# EAGLE design trackuino-shield (EAGLE 5.11)
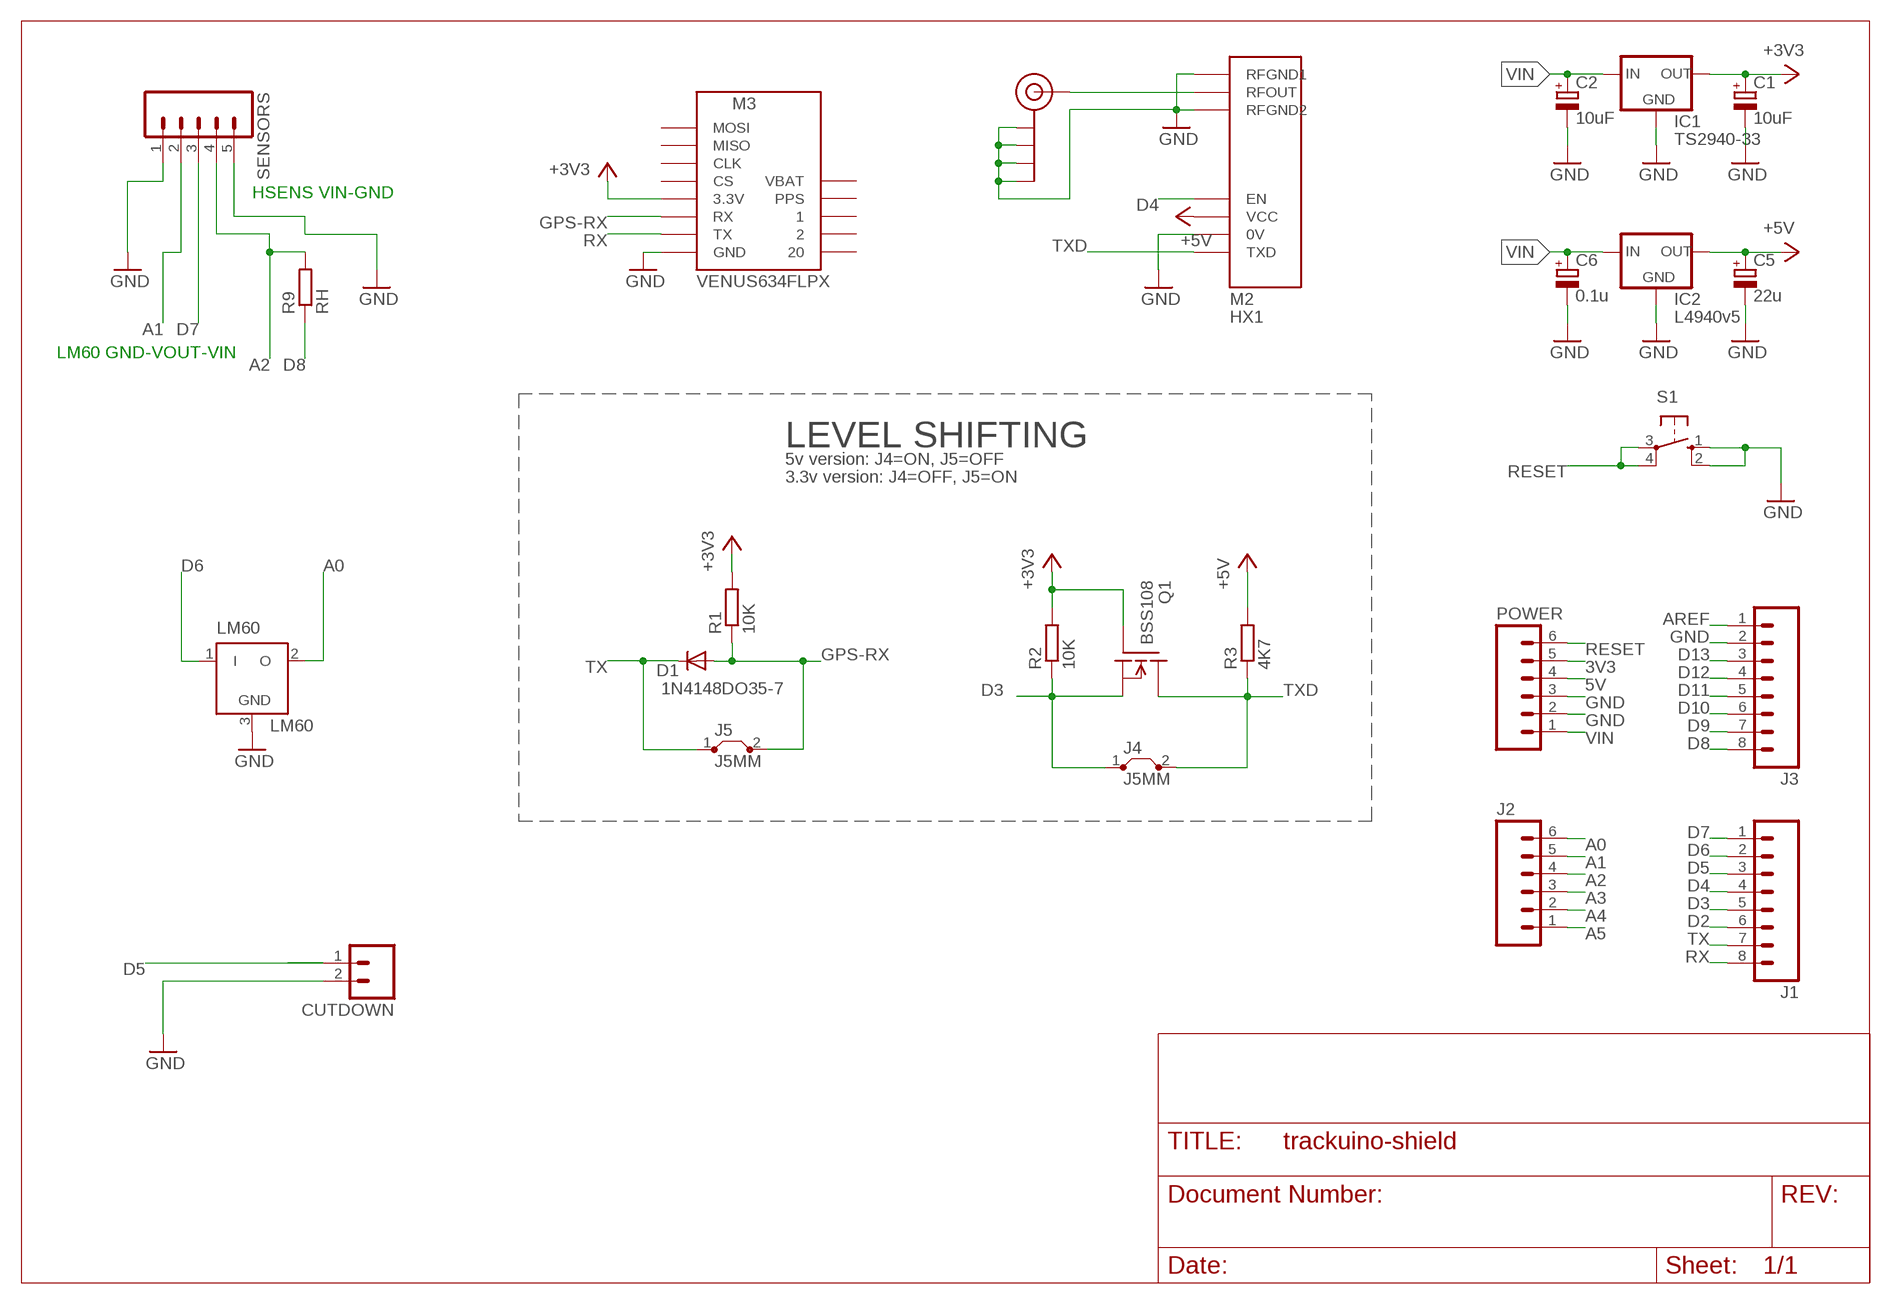
[diagram p0: schematic, sheet 1]

## Parts
C1  10uF  CPOL-EUE2.5-5  [E2,5-5]
C2  10uF  CPOL-EUE2.5-5  [E2,5-5]
C5  22u  CPOL-EUE2.5-5  [E2,5-5]
C6  0.1u  CPOL-EUE2.5-5  [E2,5-5]
CUTDOWN  M02  [1X02_LONGPADS]
D1  1N4148DO35-7  [DO35-7]
IC1  TS2940-33  78XXL  [78XXL]
IC2  L4940v5  78XXL  [78XXL]
J1  M08LONGPADS  [1X08_LONGPADS]
J2  M06LONGPADS  [1X06_LONGPADS]
J3  M08LONGPADS  [1X08_LONGPADS]
J4  J5MM  [05]
J5  J5MM  [05]
J$1  SMA_EDGE  [SMA-EDGE]
LM60  LM60  [TO92]
M2  HX1  [HX1]
M3  VENUS634FLPX  [VENUS634FLPX]
POWER  M06LONGPADS  [1X06_LONGPADS]
Q1  BSS108  BSS101  [TO92]
R1  10K  R-EU_0207/7  [0207/7]
R2  10K  R-EU_0207/7  [0207/7]
R3  4K7  R-EU_0207/7  [0207/7]
R9  RH  R-EU_0207/7  [0207/7]
S1  10-XX  [B3F-10XX]
SENSORS  M05PTH_LONGPADS  [1X05_LONGPADS]

## Nets
3V3: POWER.5
5V: POWER.4
+3V3: C1.+ IC1.OUT M3.3.3V Q1.2(G) R1.2 R2.2
+5V: C5.+ IC2.OUT M2.VCC R3.2
A0: J2.6 LM60.2(O)
A1: J2.5 SENSORS.2
A2: J2.4 R9.2 SENSORS.4
A3: J2.3
A4: J2.2
A5: J2.1
AREF: J3.1
D2: J1.6
D3: J1.5 J4.1 Q1.1(S) R2.1
D4: J1.4 M2.EN
D5: CUTDOWN.1 J1.3
D6: J1.2 LM60.1(I)
D7: J1.1 SENSORS.3
D8: J3.8 R9.1
D9: J3.7
D10: J3.6
D11: J3.5
D12: J3.4
D13: J3.3
GND: C1.- C2.- C5.- C6.- CUTDOWN.2 IC1.GND IC2.GND J3.2 J$1.GND@0(GND) J$1.GND@1(GND) J$1.GND@2(GND) J$1.GND@3(GND) LM60.3(GND) M2.0V M2.RFGND1 M2.RFGND2 M3.GND POWER.2 POWER.3 S1.1(S) S1.2(S1) SENSORS.1 SENSORS.5
GPS-RX: D1.A J5.2 M3.RX R1.1
N$2: J$1.SIG(SIGNAL) M2.RFOUT
RESET: POWER.6 S1.3(P) S1.4(P1)
RX: J1.8 M3.TX
TX: D1.C J1.7 J5.1
TXD: J4.2 M2.TXD Q1.3(D) R3.1
VIN [30]: C2.+ C6.+ IC1.IN IC2.IN POWER.1
Unconnected: M3.1 M3.2 M3.20 M3.CLK M3.CS M3.MISO M3.MOSI M3.PPS M3.VBAT

## Notes on the sheet
- HSENS VIN-GND
- LM60 GND-VOUT-VIN
- LEVEL SHIFTING
- 5v version: J4=ON, J5=OFF
- 3.3v version: J4=OFF, J5=ON

## Library data of the parts
C1 C2 C5 C6 = rcl:CPOL-EU: POLARIZED CAPACITOR, European symbol
CUTDOWN = SparkFun:M02: Header 2 Standard 2-pin 0.1" header. Use with straight break away headers (SKU : PRT-00116), right angle break away headers (PRT-00553), swiss pins (PRT-00743), machine pins (PRT-00117), and female headers (PRT-00115). Molex polarized connector foot print use with SKU : PRT-08233 with associated crimp pins and housings.
D1 = diode:1N4148: DIODE high speed (Philips)
IC1 IC2 = v-reg:78XXL: VOLTAGE REGULATOR
J1 J3 = SparkFun:M08: Header 8 Standard 8-pin 0.1" header. Use with straight break away headers (SKU : PRT-00116), right angle break away headers (PRT-00553), swiss pins (PRT-00743), machine pins (PRT-00117), and female headers (PRT-00115).
J2 POWER = SparkFun:M06: Header 6 Standard 6-pin 0.1" header. Use with straight break away headers (SKU : PRT-00116), right angle break away headers (PRT-00553), swiss pins (PRT-00743), machine pins (PRT-00117), and female headers (PRT-00115). Molex polarized connector foot print use with SKU : PRT-08094 with associated crimp pins and housings. NOTES ON THE VARIANTS LOCK and LOCK_LONGPADS... This footprint was designed to help hold the alignment of a through-hole component (i.e. 6-pin header) while soldering it into place. You may notice that each hole has been shifted either up or down by 0.005 of an inch from it's more standard position (which is a perfectly straight line). This slight alteration caused the pins (the squares in the middle) to touch the edges of the holes. Because they are alternating, it causes a "brace" to hold the component in place. 0.005 has proven to be the perfect amount of "off-center" position when using our standard breakaway headers. Although looks a little odd when you look at the bare footprint, once you have a header in there, the alteration is very hard to notice. Also, if you push a header all the way into place, it is covered up entirely on the bottom side. This idea of altering the position of holes to aid alignment will be further integrated into the Sparkfun Library for other footprints. It can help hold any component with 3 or more connection pins.
J4 J5 = jumper:J: Bridge
J$1 = SparkFun:SMA_EDGE: SMA Antenna Connector End launch SMA connector. The paste layer has been removed so that the connector can be hand soldered onto the board after reflow.
LM60 = trackuino:LM60
M2 = trackuino:HX1
M3 = trackuino:VENUS634FLPX
Q1 = transistor-fet:BSS101: N-Channel Enhancement MOSFET 200V; 0,16A; 11Ohm
R1-R3 R9 = resistor:R-EU_: RESISTOR, European symbol
S1 = switch-omron:10-XX: OMRON SWITCH
SENSORS = SparkFun:M05: Header 5 Standard 5-pin 0.1" header. Use with straight break away headers (SKU : PRT-00116), right angle break away headers (PRT-00553), swiss pins (PRT-00743), machine pins (PRT-00117), and female headers (PRT-00115). Molex polarized connector foot print use with SKU : PRT-08230 with associated crimp pins and housings.

## Net classes
0 10: width 0.254 mm
1 15: width 0.381 mm
2 20: width 0.508 mm
3 30: width 0.762 mm
4 40: width 1.016 mm
5 50: width 1.27 mm
6 HIGH Current: width 2.54 mm

## Board
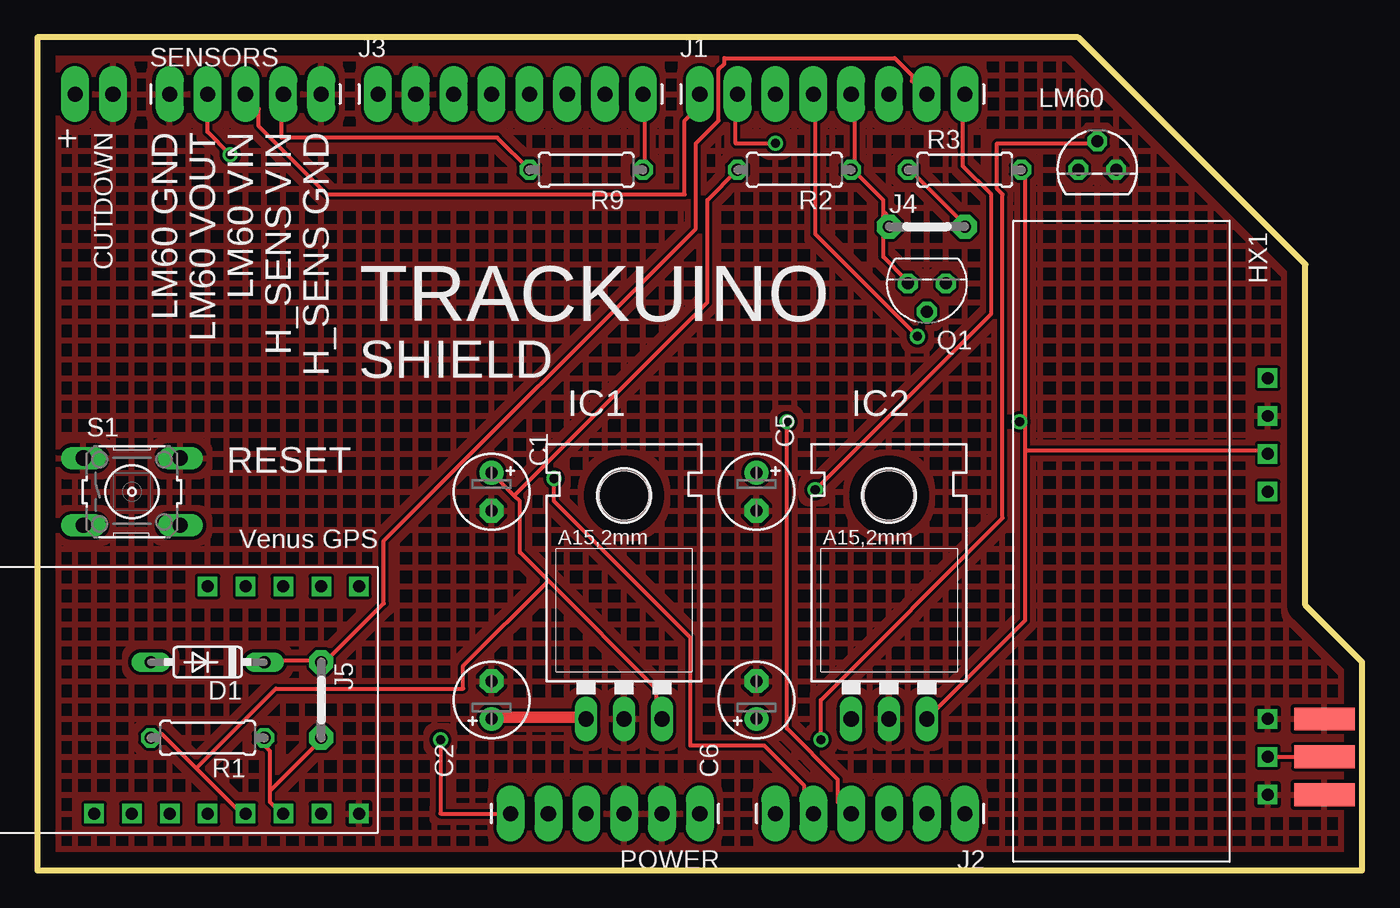
[diagram p1: board, top side]
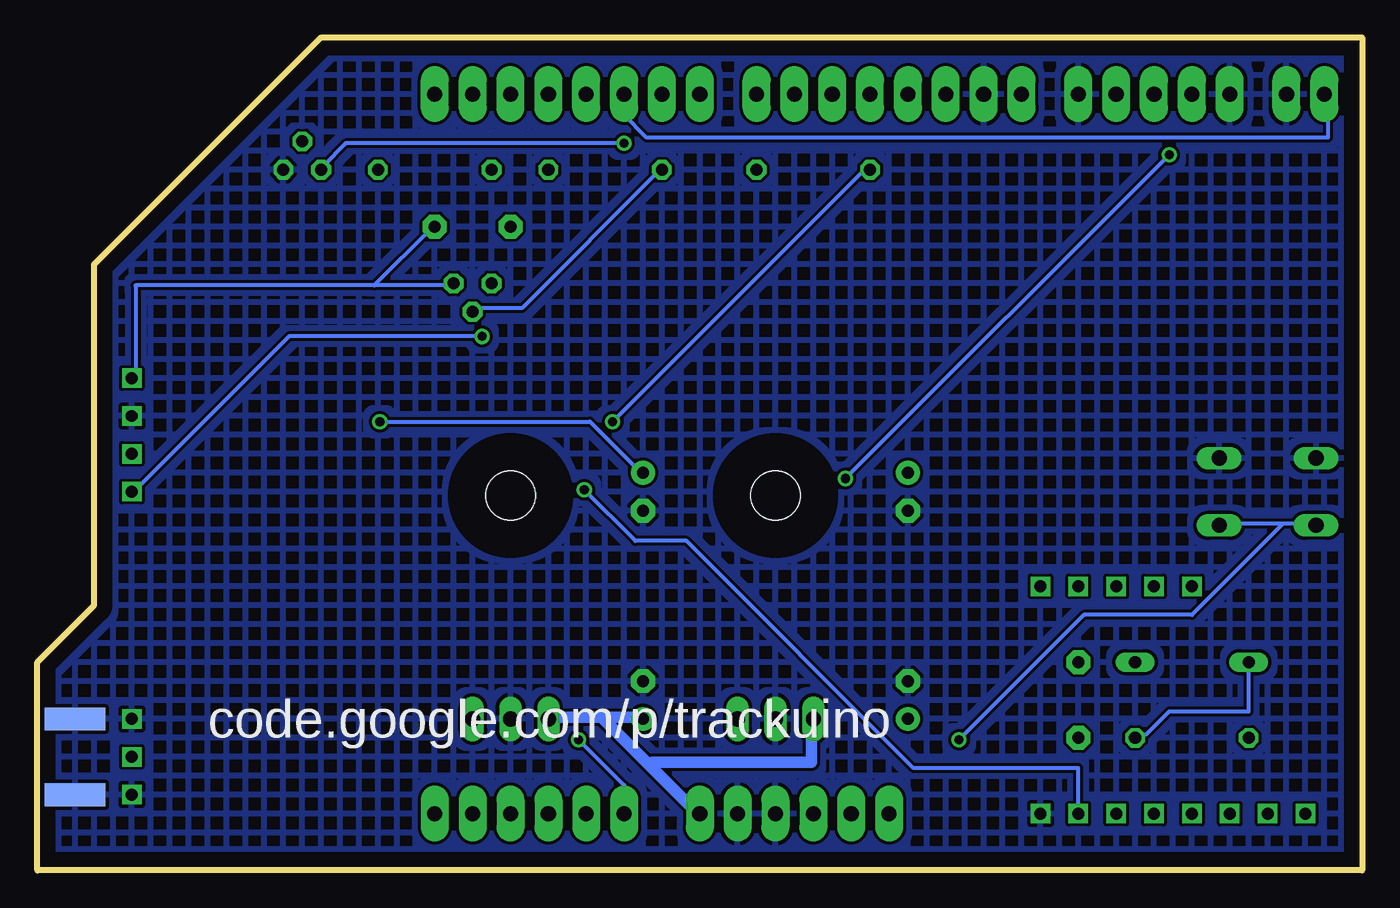
[diagram p2: board, bottom side, seen from below]

Size 88.9 x 55.88 mm. Coordinates in mm from the lower left corner, seen from the top.
Outline: 69.85,55.88 0,55.88 0,0 88.9,0 88.9,13.97 85.09,17.78 85.09,40.64 69.85,55.88
Copper layers (1*16): Top 0.035mm / dielectric 1.5mm / Bottom 0.035mm
Design rules "default": minimum track width 10mil, minimum drill 24mil, track to track 8mil, track to pad 8mil, pad to pad 8mil, via to via 8mil, smd to smd 8mil, copper to edge 40mil, drill to drill 8mil, minimum pad ring 10mil, minimum via ring 8mil, stop-mask expansion 4mil, vias tented up to drill 0mil, thermal gap 10mil

### Footprints (pad centres in the part's own frame; a part is rotated, then mirrored left to right if it is on the bottom)
E2,5-5 = drill 0.813 pad 1.6 round: + -1.27,0 | drill 0.813 pad 1.6 octagon: - 1.27,0
1X02_LONGPADS = drill 1.016 pad 1.88 long: 1 0,0; 2 2.54,0
DO35-7 = drill 0.813 long: A 3.81,0; C -3.81,0
78XXL = drill 1.016 long: GND 0,-3.81; IN -2.54,-3.81; OUT 2.54,-3.81 | hole 3.302: 0,11.176
1X08_LONGPADS = drill 1.016 pad 1.88 long: 1 0,0; 2 2.54,0; 3 5.08,0; 4 7.62,0; 5 10.16,0; 6 12.7,0; 7 15.24,0; 8 17.78,0
1X06_LONGPADS = drill 1.016 pad 1.88 long: 1 0,0; 2 2.54,0; 3 5.08,0; 4 7.62,0; 5 10.16,0; 6 12.7,0
05 = drill 0.813 pad 1.6 octagon: 1 -2.54,0; 2 2.54,0
SMA-EDGE = smd 1.524 x 4.064: GND@0 0,0; GND@1 5.08,0; SIG 2.54,0 | smd 1.524 x 4.064 bottom: GND@2 0,0; GND@3 5.08,0
TO92 = drill 0.813 octagon: 1 -1.27,0; 2 0,1.905; 3 1.27,0
HX1 = drill 0.8 square: 0V 25.4,-8.89; EN 20.32,-8.89; RFGND1 0,-8.89; RFGND2 5.08,-8.89; RFOUT 2.54,-8.89; TXD 27.94,-8.89; VCC 22.86,-8.89
VENUS634FLPX = drill 0.8 square: 1 6.35,1.27; 2 3.81,1.27; 3.3V 8.89,16.51; 20 1.27,1.27; CLK 13.97,16.51; CS 11.43,16.51; GND 1.27,16.51; MISO 16.51,16.51; MOSI 19.05,16.51; PPS 8.89,1.27; RX 6.35,16.51; TX 3.81,16.51; VBAT 11.43,1.27
TO92' = drill 0.813 octagon: 1 1.27,0; 2 0,1.905; 3 -1.27,0
0207/7 = drill 0.813 octagon: 1 -3.81,0; 2 3.81,0
B3F-10XX = drill 1.016 long: 1 -3.251,2.261; 2 3.251,2.261; 3 -3.251,-2.261; 4 3.251,-2.261
1X05_LONGPADS = drill 1.016 pad 1.88 long: 1 0,0; 2 2.54,0; 3 5.08,0; 4 7.62,0; 5 10.16,0

### Placement (x,y rotation side)
C1  30.48,25.4 270 top
C2  30.48,11.43 90 top
C5  48.26,25.4 270 top
C6  48.26,11.43 90 top
CUTDOWN  2.54,52.07 0 top
D1  11.43,13.97 180 top
IC1  39.37,13.97 0 top
IC2  57.15,13.97 0 top
J1  44.45,52.07 0 top
J2  62.23,3.81 180 top
J3  22.86,52.07 0 top
J4  59.69,43.18 0 top
J5  19.05,11.43 270 top
J$1  86.36,5.08 90 top
LM60  71.12,46.99 0 top
M2  73.66,5.08 90 top
M3  22.86,20.32 180 top
POWER  44.45,3.81 180 top
Q1  BSS108  [TO92']  59.69,39.37 180 top
R1  11.43,8.89 180 top
R2  50.8,46.99 180 top
R3  62.23,46.99 0 top
R9  36.83,46.99 180 top
S1  6.35,25.4 0 top
SENSORS  8.89,52.07 0 top

### Tracks (layer width: path | path; a pad name or v marks a point on that pad's centre or on a via)
+3V3
  Top 0.254: 10.67,6.86 8.38,9.14 7.62,9.14 R1.2 | 10.67,6.86 13.72,3.81 M3.3.3V | 34.29,19.43 32.38,21.34 32.38,24.77 32,25.15 | 34.29,19.43 41.53,12.19 41.53,10.67 41.91,10.29 IC1.OUT | 32,25.15 C1.+ | 10.67,6.86 16,12.19 28.57,12.19 28.57,13.72 34.29,19.43 | 32,25.15 44.96,38.1 44.96,44.96 R2.2
  Bottom 0.254: R2.2 47.24,46.86 56.39,37.72 59.44,37.72 Q1.2
+5V  (via drill 0.61)
  Top 0.254: 66.29,28.19 82.3,28.19 M2.VCC | 66.29,30.1 66.29,46.86 R3.2 | 66.29,28.19 66.29,30.1 | 66.29,28.19 66.29,16.76 IC2.OUT | 66.29,30.1 v65.91,30.1
  Bottom 0.254: v65.91,30.1 51.82,30.1 48.39,26.67 C5.+
A0  (via drill 0.61)
  Top 0.254: v52.58,8.76 52.58,11.43 64.77,23.62 64.77,45.34 64.39,45.72 64.39,48.77 70.87,48.77 LM60.2
  Bottom 0.254: v52.58,8.76 49.53,5.71 J2.6
A1  (via drill 0.61)
  Top 0.254: v34.67,26.29 34.67,24.77 43.81,15.62 43.81,8.38 48.77,8.38 51.44,5.71 51.44,4.19 51.82,3.81 J2.5 | v12.95,48.01 11.43,49.53 SENSORS.2
  Bottom 0.254: v34.67,26.29 v12.95,48.01
A2  (via drill 0.61)
  Top 0.254: R9.2 30.86,49.15 16.38,49.15 16.38,51.82 SENSORS.4 | v50.29,30.1 50.29,9.53 53.72,6.1 53.72,4.57 54.48,3.81 J2.4
  Bottom 0.254: v50.29,30.1 33.53,46.86 33.15,46.86 R9.2
D3
  Top 0.254: 56.77,44.2 56.77,44.96 54.86,46.86 R2.1 54.86,47.24 54.86,51.82 J1.5 | 56.77,44.2 57.15,43.81 J4.1 | 56.77,44.2 56.77,41.15 58.29,39.62 Q1.1
D4  (via drill 0.61)
  Top 0.254: v59.05,35.81 52.2,42.67 52.2,51.82 J1.4
  Bottom 0.254: v59.05,35.81 72.01,35.81 82.3,25.53 M2.EN
D5
  Bottom 0.254: CUTDOWN.1 2.29,51.82 2.29,49.15 48.01,49.15 49.53,50.67 J1.3
D6  (via drill 0.61)
  Top 0.254: v49.53,48.77 46.86,48.77 46.86,51.82 J1.2
  Bottom 0.254: v49.53,48.77 68.2,48.77 69.72,47.24 LM60.1
D7
  Top 0.254: SENSORS.3 14.1,51.82 14.86,51.05 14.86,49.91 19.43,45.34 43.43,45.34 43.43,50.29 44.2,51.05 44.2,51.82 J1.1
D8
  Top 0.254: R9.1 40.77,47.24 40.77,51.82 J3.8
GND
  pour Top (hatched): 0,55.88 69.85,55.88 85.09,40.64 85.09,17.78 88.9,13.97 88.9,0 0,0
  pour Bottom (hatched): 0,55.88 69.85,55.88 85.09,40.64 85.09,17.78 88.9,13.97 88.9,0 0,0
GPS-RX
  Top 0.254: 15.62,5.33 15.62,8 15.24,8.38 R1.1 | 15.62,5.33 15.62,4.57 16.38,3.81 M3.RX | 15.62,5.33 19.05,8.76 J5.2
  Bottom 0.254: D1.A 7.62,10.67 12.95,10.67 14.48,9.14 15.24,9.14 R1.1
N$2
  Top 0.254: M2.RFOUT J$1.SIG
RESET  (via drill 0.61)
  Top 0.254: v27.05,8.76 27.05,3.81 POWER.6
  Bottom 0.254: 5.33,23.24 9.53,23.24 S1.4 | 5.33,23.24 3.43,23.24 S1.3 | v27.05,8.76 18.67,17.14 11.43,17.14 5.33,23.24
RX  (via drill 0.61)
  Top 0.254: v52.2,25.53 64.01,37.34 64.01,45.34 62.1,47.24 62.1,51.82 J1.8
  Bottom 0.254: M3.TX 19.05,6.86 30.1,6.86 45.34,22.1 48.77,22.1 v52.2,25.53
TX
  Top 0.254: D1.C 15.24,14.1 19.05,14.1 J5.1 19.05,13.72 23.24,17.91 23.24,22.1 44.2,43.05 44.2,48.77 45.72,50.29 45.72,53.72 46.1,54.1 46.1,54.48 57.53,54.48 58.67,53.34 58.67,52.96 59.44,52.2 J1.7
TXD
  Top 0.254: R3.1 58.67,46.86 62.1,43.43 J4.2
  Bottom 0.254: 66.29,39.24 60.96,39.24 Q1.3 | 66.29,39.24 82.3,39.24 82.3,33.15 M2.TXD | 66.29,39.24 62.48,43.05 J4.2
VIN
  Top 0.762: IC1.IN 36.58,10.29 30.48,10.29 C2.+
  Bottom 0.762: 51.05,10.29 48.39,10.29 C6.+ | 51.05,10.29 54.48,10.29 IC2.IN | 47.82,7.05 51.05,10.29 | 47.82,7.05 44.58,3.81 POWER.1 | IC1.IN 36.96,9.91 36.96,7.24 47.62,7.24 47.82,7.05

### Text on the board
tPlace: LM60 GND | LM60 VOUT | LM60 VIN | H_SENS VIN | H_SENS GND
tNames: + | TRACKUINO | SHIELD | RESET
bNames: code.google.com/p/trackuino